# Altium schematic sheet WHEEL-MOTORs .SchDoc
size A4; SheetNumber: 23; SheetTotal: 32
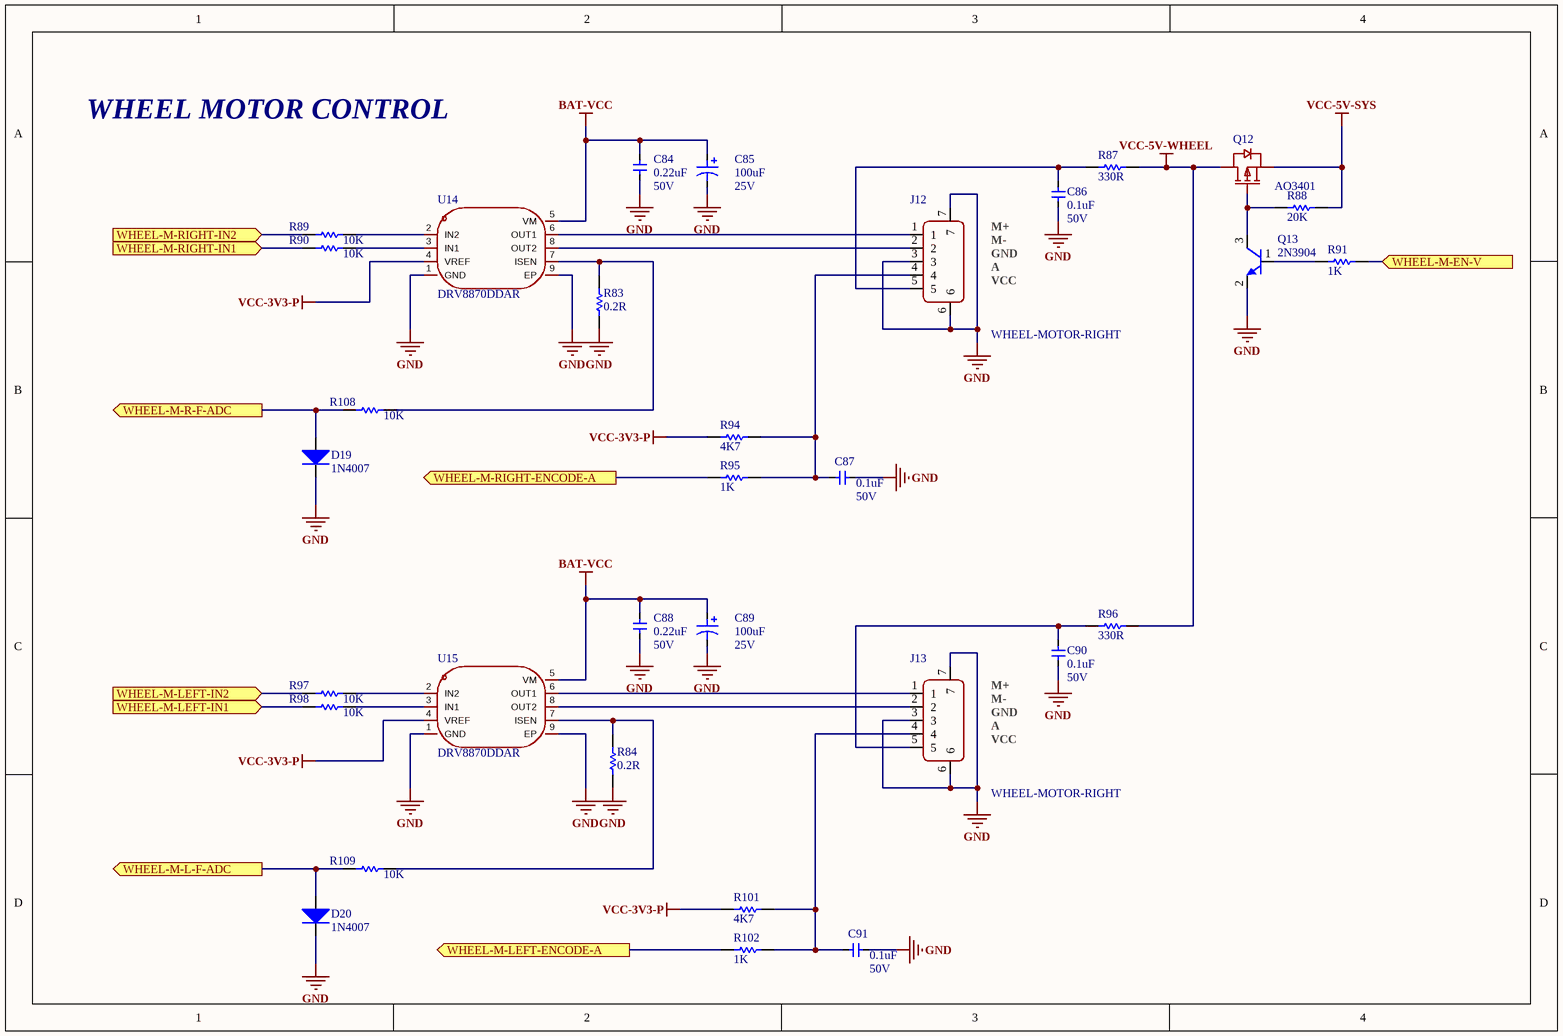
[diagram p0: WHEEL-MOTORs .SchDoc]

## Parts
C84  0.22uF  VoltageRate: 50V  [CAP-0402]
C85  100uF  VoltageRate: 25V  [CAP-SMD_BD6.3-L6.6-W6.6-FD]
C86  0.1uF  VoltageRate: 50V  [CAP-0402]
C87  0.1uF  VoltageRate: 50V  [CAP-0402]
C88  0.22uF  VoltageRate: 50V  [CAP-0402]
C89  100uF  VoltageRate: 25V  [CAP-SMD_BD6.3-L6.6-W6.6-FD]
C90  0.1uF  VoltageRate: 50V  [CAP-0402]
C91  0.1uF  VoltageRate: 50V  [CAP-0402]
D19  1N4007  [SOD123]
D20  1N4007  [SOD123]
J12  WHEEL-MOTOR-RIGHT  [CONN-SMD_5P-P1.50_ZX-ZH1.5-5PWT]
J13  WHEEL-MOTOR-RIGHT  [CONN-SMD_5P-P1.50_ZX-ZH1.5-5PWT]
Q12  AO3401  [SOT23-3D]
Q13  2N3904  [SOT23-3D]
R83  0.2R  [RES-0603]
R84  0.2R  [RES-0603]
R87  330R  [RES-0603]
R88  20K  [RES-0402]
R89  10K  [RES-0402]
R90  10K  [RES-0402]
R91  1K  [RES-0402]
R94  4K7  [RES-0402]
R95  1K  [RES-0402]
R96  330R  [RES-0603]
R97  10K  [RES-0402]
R98  10K  [RES-0402]
R101  4K7  [RES-0402]
R102  1K  [RES-0402]
R108  10K  [RES-0402]
R109  10K  [RES-0402]
U14  DRV8870DDAR  [HSOP-8_L5.0-W4.0-P1.27-LS6.2-BL-EP]
U15  DRV8870DDAR  [HSOP-8_L5.0-W4.0-P1.27-LS6.2-BL-EP]

## Ports
WHEEL-M-EN-V (in, see Controller-RK3562-TOP[2B], STM32G070RBT6[2C]), WHEEL-M-L-F-ADC (out, see Controller-RK3562-TOP[2C], STM32G070RBT6[2C]), WHEEL-M-LEFT-ENCODE-A (out, see Controller-RK3562-TOP[2C], STM32G070RBT6[1B]), WHEEL-M-LEFT-IN1 (in, see Controller-RK3562-TOP[2B], STM32G070RBT6[2B]), WHEEL-M-LEFT-IN2 (in, see Controller-RK3562-TOP[2B], STM32G070RBT6[2B]), WHEEL-M-R-F-ADC (out, see Controller-RK3562-TOP[2C], STM32G070RBT6[2B]), WHEEL-M-RIGHT-ENCODE-A (out, see Controller-RK3562-TOP[2B], STM32G070RBT6[1B]), WHEEL-M-RIGHT-IN1 (in, see Controller-RK3562-TOP[2B], STM32G070RBT6[2C]), WHEEL-M-RIGHT-IN2 (in, see Controller-RK3562-TOP[2B], STM32G070RBT6[2C])

## Nets
BAT-VCC: C84.2 C85.1 C88.2 C89.1 U14.5(VM) U15.5(VM)
GND: C84.1 C85.2 C86.2 C87.1 C88.1 C89.2 C90.2 C91.1 D19.2(K) D20.2(K) J12.3 J12.6 J12.7 J13.3 J13.6 J13.7 Q13.2(E) R83.1 R84.1 U14.1(GND) U14.9(EP) U15.1(GND) U15.9(EP)
VCC-3V3-P: R94.1 R101.1 U14.4(VREF) U15.4(VREF)
VCC-5V-SYS: Q12.2(S) R88.2
VCC-5V-WHEEL: Q12.3(D) R87.2 R96.2
WHEEL-M-EN-V: R91.2 ; port WHEEL-M-EN-V
WHEEL-M-L-F-ADC: D20.1(A) R109.1 ; port WHEEL-M-L-F-ADC
WHEEL-M-LEFT-ENCODE-A: R102.1 ; port WHEEL-M-LEFT-ENCODE-A
WHEEL-M-LEFT-IN1: R98.1 ; port WHEEL-M-LEFT-IN1
WHEEL-M-LEFT-IN2: R97.1 ; port WHEEL-M-LEFT-IN2
WHEEL-M-R-F-ADC: D19.1(A) R108.1 ; port WHEEL-M-R-F-ADC
WHEEL-M-RIGHT-ENCODE-A: R95.1 ; port WHEEL-M-RIGHT-ENCODE-A
WHEEL-M-RIGHT-IN1: R90.1 ; port WHEEL-M-RIGHT-IN1
WHEEL-M-RIGHT-IN2: R89.1 ; port WHEEL-M-RIGHT-IN2
NetC86_1: C86.1 J12.5 R87.1
NetC87_2: C87.2 J12.4 R94.2 R95.2
NetC90_1: C90.1 J13.5 R96.1
NetC91_2: C91.2 J13.4 R101.2 R102.2
NetJ12_1: J12.1 U14.6(OUT1)
NetJ12_2: J12.2 U14.8(OUT2)
NetJ13_1: J13.1 U15.6(OUT1)
NetJ13_2: J13.2 U15.8(OUT2)
NetQ12_1: Q12.1(G) Q13.3(C) R88.1
NetQ13_1: Q13.1(B) R91.1
NetR83_2: R83.2 R108.2 U14.7(ISEN)
NetR84_2: R84.2 R109.2 U15.7(ISEN)
NetR89_2: R89.2 U14.2(IN2)
NetR90_2: R90.2 U14.3(IN1)
NetR97_2: R97.2 U15.2(IN2)
NetR98_2: R98.2 U15.3(IN1)

## Notes on the sheet
- WHEEL MOTOR CONTROL
- M+
- (near J12) M-
- (near J12) GND
- (near J12) A
- (near J12) VCC
- (near J13) M-
- (near J13) GND
- (near J13) A
- (near J13) VCC

## Library data of the parts
C84 C86-C88 C90 C91 = Capacitor-1: ManufacturingPartNumber: *; Manufacturer: *; SupplierPartNumber: *; Supplier: *
C85 C89 = Capacitor-2: ManufacturingPartNumber: *; Manufacturer: *; SupplierPartNumber: *; Supplier: *
D19 D20 = DIODE-1: ManufacturingPartNumber: *; Manufacturer: *; SupplierPartNumber: *; Supplier: *; VoltageRate: *
J12 J13 = HDRx5: ManufacturingPartNumber: *; Manufacturer: *; SupplierPartNumber: *; Supplier: *; VoltageRate: *
Q12 = P-MOS-SOT23: ManufacturingPartNumber: *; Manufacturer: *; SupplierPartNumber: *; Supplier: *; VoltageRate: *
Q13 = NPN-SOT23: ManufacturingPartNumber: *; Manufacturer: *; SupplierPartNumber: *; Supplier: *; VoltageRate: *
R83 R84 R87-R91 R94-R98 R101 R102 R108 R109 = Resistor-1: ManufacturingPartNumber: *; Manufacturer: *; SupplierPartNumber: *; Supplier: *; VoltageRate: *
U14 U15 = DRV8870: ManufacturingPartNumber: *; Manufacturer: *; SupplierPartNumber: *; Supplier: *; VoltageRate: *